# EAGLE design doodle with clock2 no fil (EAGLE 6.2)
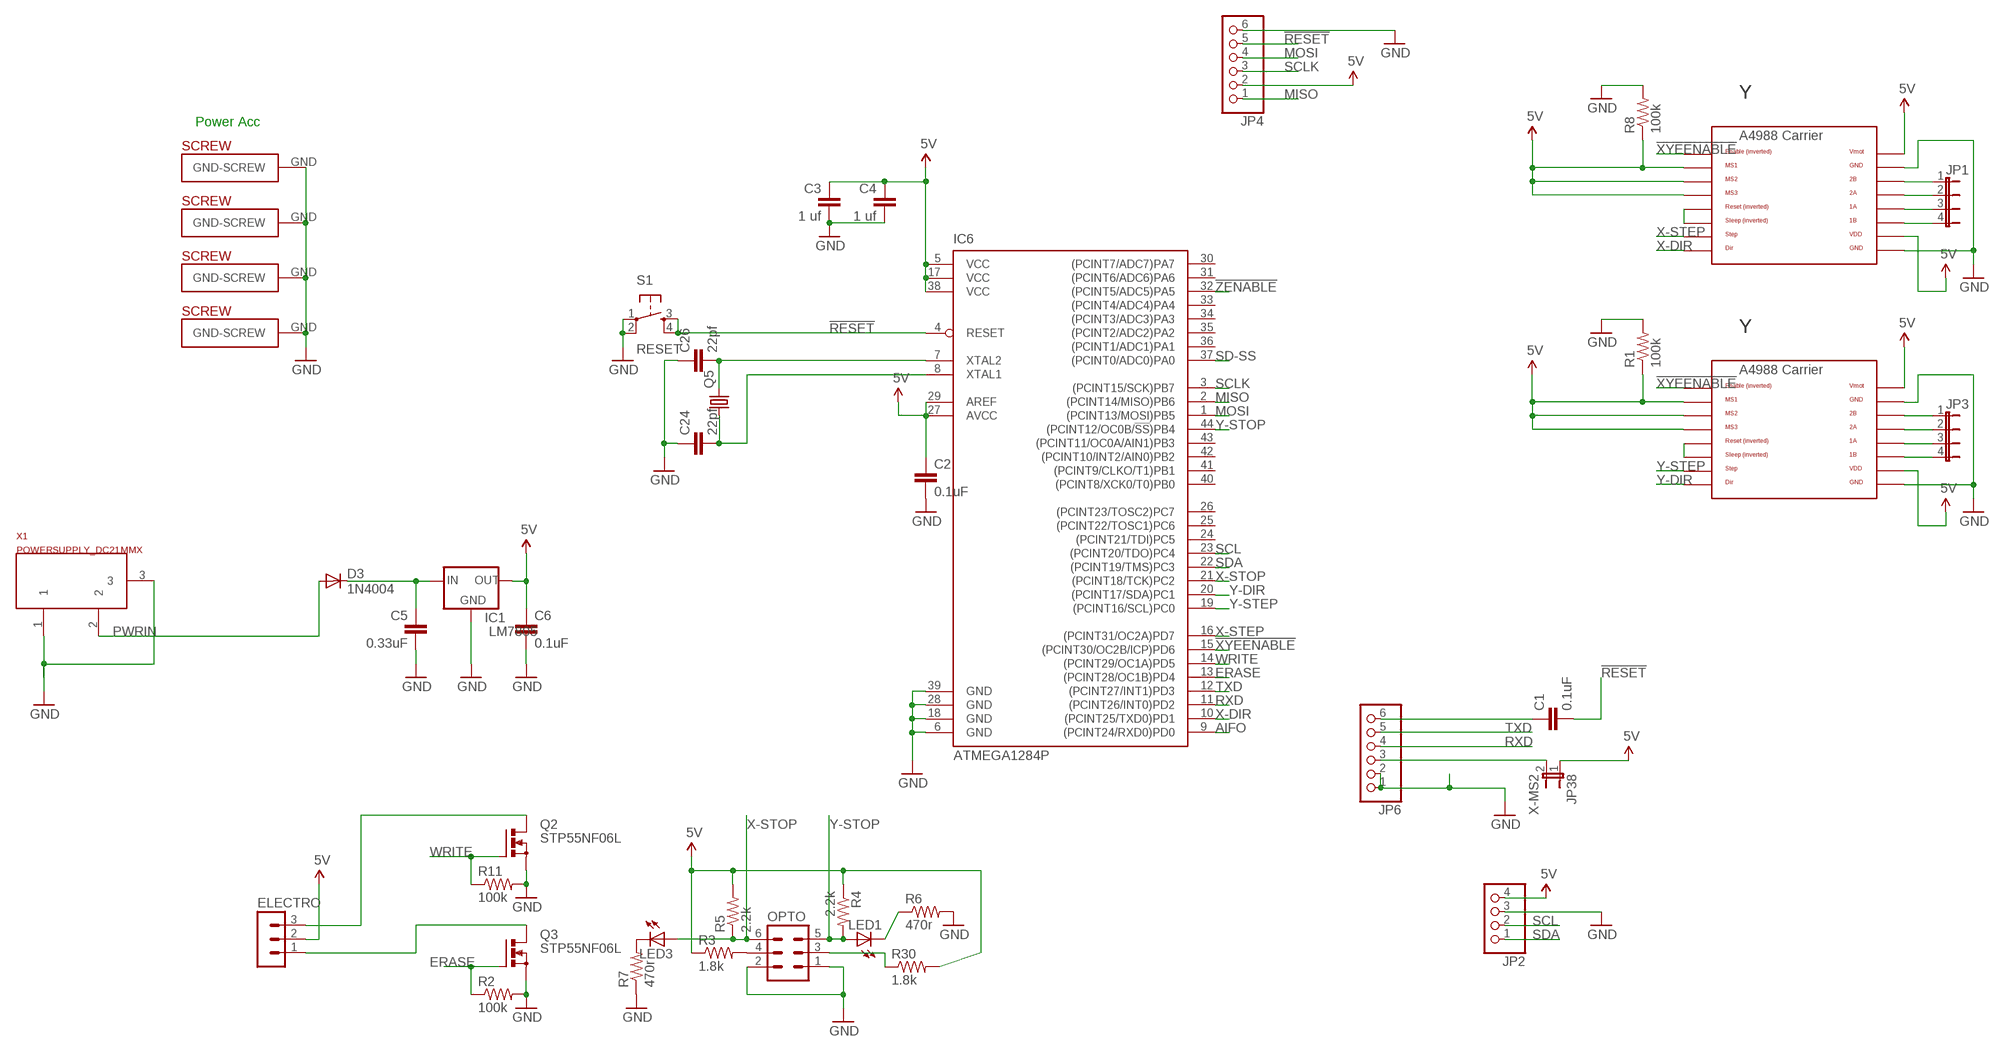
[diagram p0: schematic, sheet 1]

## Parts
C1  0.1uF  CAPPTH2  [CAP-PTH-SMALL2]
C2  0.1uF  CAPPTH2  [CAP-PTH-SMALL2]
C3  1 uf  CAPPTH2  [CAP-PTH-SMALL2]
C4  1 uf  CAPPTH2  [CAP-PTH-SMALL2]
C5  0.33uF  CAPPTH2  [CAP-PTH-SMALL2]
C6  0.1uF  CAPPTH2  [CAP-PTH-SMALL2]
C24  22pf  CAPPTH2  [CAP-PTH-SMALL2]
C26  22pf  CAPPTH2  [CAP-PTH-SMALL2]
D3  1N4004  [DO41-10]
ELECTRO  MA03-1  [MA03-1]
IC1  LM7805  V_REG_78XX  [78XXL-CUSTOM]
IC6  ATMEGA1284P  ATMEGA644A  [TQFP44]
JP1  JP4E  [JP4]
JP2  PINHD-1X4  [1X04]
JP3  JP4E  [JP4]
JP4  PINHD-1X6/90  [1X06/90]
JP6  PINHD-1X6  [1X06]
JP38  X-MS2  JUMPER-2PTH  [1X02]
LED1  LED3MM  [LED3MM]
LED3  LED3MM  [LED3MM]
OPTO  MA03-2  [MA03-2]
Q2  STP55NF06L  IRF512  [TO220BV]
Q3  STP55NF06L  IRF512  [TO220BV]
Q5  CRYSTALHC49S  [HC49/S]
R1  100k  R-US_0207/7  [0207/7]
R2  100k  R-US_0207/2V  [0207/2V]
R3  1.8k  R-US_0207/2V  [0207/2V]
R4  2.2k  R-US_0207/2V  [0207/2V]
R5  2.2k  R-US_0207/2V  [0207/2V]
R6  470r  R-US_0207/2V  [0207/2V]
R7  470r  R-US_0207/2V  [0207/2V]
R8  100k  R-US_0207/7  [0207/7]
R11  100k  R-US_0207/2V  [0207/2V]
R30  1.8k  R-US_0207/2V  [0207/2V]
S1  RESET  TAC_SWITCHPTH  [TACTILE-PTH]
U$1  A4988BREAKOUT  [A4988BREAKOUT]
U$7  A4988BREAKOUT  [A4988BREAKOUT]
U$14  PLATED-SCREW  [PLATEDSCREW]
U$17  PLATED-SCREW  [PLATEDSCREW]
U$18  PLATED-SCREW  [PLATEDSCREW]
U$38  PLATED-SCREW  [PLATEDSCREW]
X1  POWERSUPPLY_DC21MMX  [POWERSUPPLY_DC-21MM]

## Nets
5V: C2.1 C3.1 C4.1 C6.1 ELECTRO.2 IC1.OUT IC6.5(VCC) IC6.17(VCC) IC6.27(AVCC) IC6.29(AREF) IC6.38(VCC) JP2.4 JP4.2 JP38.1 R1.1 R3.1 R4.1 R5.2 R8.1 R30.2 U$1.MS1 U$1.MS2 U$1.MS3 U$1.VDD U$1.VMOT U$7.MS1 U$7.MS2 U$7.MS3 U$7.VDD U$7.VMOT
!RESET: C1.2 IC6.4(RESET) JP4.5 S1.3 S1.4
!XYEENABLE: IC6.15((PCINT30/OC2B/ICP)PD6) U$1.EN U$7.EN
!ZENABLE: IC6.32((PCINT5/ADC5)PA5)
AIFO: IC6.9((PCINT24/RXD0)PD0)
ERASE: IC6.13((PCINT28/OC1B)PD4) Q3.G R2.1
GND: C2.2 C3.2 C4.2 C5.2 C6.2 C24.1 C26.1 IC1.GND IC6.6(GND) IC6.18(GND) IC6.28(GND) IC6.39(GND) JP2.3 JP4.6 JP6.1 JP6.2 OPTO.1 OPTO.2 Q2.S Q3.S R1.2 R2.2 R6.2 R7.1 R8.2 R11.2 S1.1 S1.2 U$1.GND U$1.GND@0(GND) U$7.GND U$7.GND@0(GND) U$14.GND(GND-SCREW) U$17.GND(GND-SCREW) U$18.GND(GND-SCREW) U$38.GND(GND-SCREW) X1.1 X1.3
MISO: IC6.2((PCINT14/MISO)PB6) JP4.1
MOSI: IC6.1((PCINT13/MOSI)PB5) JP4.4
N$1: U$1.RST U$1.SLP(SLEEP)
N$2: JP3.1 U$1.2B
N$3: JP3.2 U$1.2A
N$4: JP3.3 U$1.1A
N$5: JP3.4 U$1.1B
N$8: ELECTRO.1 Q3.D
N$9: OPTO.4 R3.2
N$10: ELECTRO.3 Q2.D
N$11: LED1.K(C) R6.1
N$12: LED3.K(C) R7.2
N$13: OPTO.3 R30.1
N$14: JP1.1 U$7.2B
N$15: JP1.2 U$7.2A
N$16: JP1.3 U$7.1A
N$17: JP1.4 U$7.1B
N$23: U$7.RST U$7.SLP(SLEEP)
N$68: C5.1 D3.C IC1.IN
N$70: C1.1 JP6.6
N$71: JP6.3 JP38.2
N$80: C26.2 IC6.7(XTAL2) Q5.2
N$81: C24.2 IC6.8(XTAL1) Q5.1
PWRIN [Power]: D3.A X1.2
RXD: IC6.11((PCINT26/INT0)PD2) JP6.4
SCL: IC6.23((PCINT20/TDO)PC4) JP2.2
SCLK: IC6.3((PCINT15/SCK)PB7) JP4.3
SD-SS: IC6.37((PCINT0/ADC0)PA0)
SDA: IC6.22((PCINT19/TMS)PC3) JP2.1
TXD: IC6.12((PCINT27/INT1)PD3) JP6.5
WRITE: IC6.14((PCINT29/OC1A)PD5) Q2.G R11.1
X-DIR: IC6.10((PCINT25/TXD0)PD1) U$7.DIR
X-STEP: IC6.16((PCINT31/OC2A)PD7) U$7.STEP
X-STOP: IC6.21((PCINT18/TCK)PC2) LED3.A OPTO.6 R5.1
Y-DIR: IC6.20((PCINT17/SDA)PC1) U$1.DIR
Y-STEP: IC6.19((PCINT16/SCL)PC0) U$1.STEP
Y-STOP: IC6.44((PCINT12/OC0B/!SS!)PB4) LED1.A OPTO.5 R4.2
Unconnected: IC6.24((PCINT21/TDI)PC5) IC6.25((PCINT22/TOSC1)PC6) IC6.26((PCINT23/TOSC2)PC7) IC6.30((PCINT7/ADC7)PA7) IC6.31((PCINT6/ADC6)PA6) IC6.33((PCINT4/ADC4)PA4) IC6.34((PCINT3/ADC3)PA3) IC6.35((PCINT2/ADC2)PA2) IC6.36((PCINT1/ADC1)PA1) IC6.40((PCINT8/XCK0/T0)PB0) IC6.41((PCINT9/CLKO/T1)PB1) IC6.42((PCINT10/INT2/AIN0)PB2) IC6.43((PCINT11/OC0A/AIN1)PB3)

## Notes on the sheet
- Y
- Power Acc
- Y

## Library data of the parts
C1-C6 C24 C26 = SparkFun:CAP: Capacitor Standard 0603 ceramic capacitor, and 0.1" leaded capacitor.
D3 = diode:1N4004: DIODE general purpose rectifier, 1 A
ELECTRO = con-lstb:MA03-1: PIN HEADER; OC_FARNELL: unknown; OC_NEWARK: unknown
IC1 = SparkFun:V_REG_78XX: Voltage Regulator Standard 7805 5V regulator. IGO (Input Ground Output). Spark Fun Electronics SKU : COM-00107
IC6 = atmel:ATMEGA644: 8-bit Microcontroller with 64K Bytes In-System Programmable Flash Source: http://www.atmel.com/dyn/resources/prod_documents/doc2593.pdf; MPN: ATMEGA644PV-10AU; OC_FARNELL: 1455123; OC_NEWARK: 58M3748
JP1 JP3 = jumper:JP4E: JUMPER
JP2 = pinhead:PINHD-1X4: PIN HEADER
JP4 JP6 = pinhead:PINHD-1X6: PIN HEADER
JP38 = SparkFun:JUMPER-2: Jumper Basic 0.1" spaced jumper. Use with breakaway headers.
LED1 LED3 = led:LED: LED OSRAM: - CHIPLED LG R971, LG N971, LY N971, LG Q971, LY Q971, LO R971, LY R971 LH N974, LH R974 LS Q976, LO Q976, LY Q976 LO Q996 - Hyper CHIPLED LW Q18S LB Q993, LB Q99A, LB R99A - SideLED LS A670, LO A670, LY A670, LG A670, LP A670 LB A673, LV A673, LT A673, LW A673 LH A674 LY A675 LS A676, LA A676, LO A676, LY A676, LW A676 LS A679, LY A679, LG A679 - Hyper Micro SIDELED® LS Y876, LA Y876, LO Y876, LY Y876 LT Y87S - SmartLED LW L88C, LW L88S LB L89C, LB L89S, LG L890 LS L89K, LO L89K, LY L89K LS L896, LA L896, LO L896, LY L896 - TOPLED LS T670, LO T670, LY T670, LG T670, LP T670 LSG T670, LSP T670, LSY T670, LOP T670, LYG T670 LG T671, LOG T671, LSG T671 LB T673, LV T673, LT T673, LW T673 LH T674 LS T676, LA T676, LO T676, LY T676, LB T676, LH T676, LSB T676, LW T676 LB T67C, LV T67C, LT T67C, LS T67K, LO T67K, LY T67K, LW E67C LS E67B, LA E67B, LO E67B, LY E67B, LB E67C, LV E67C, LT E67C LW T67C LS T679, LY T679, LG T679 LS T770, LO T770, LY T770, LG T770, LP T770 LB T773, LV T773, LT T773, LW T773 LH T774 LS E675, LA E675, LY E675, LS T675 LS T776, LA T776, LO T776, LY T776, LB T776 LHGB T686 LT T68C, LB T68C - Hyper Mini TOPLED® LB M676 - Mini TOPLED Santana® LG M470 LS M47K, LO M47K, LY M47K Source: http://www.osram.convergy.de LUXEON: - LUMILED® LXK2-PW12-R00, LXK2-PW12-S00, LXK2-PW14-U00, LXK2-PW14-V00 LXK2-PM12-R00, LXK2-PM12-S00, LXK2-PM14-U00 LXK2-PE12-Q00, LXK2-PE12-R00, LXK2-PE12-S00, LXK2-PE14-T00, LXK2-PE14-U00 LXK2-PB12-K00, LXK2-PB12-L00, LXK2-PB12-M00, LXK2-PB14-N00, LXK2-PB14-P00, LXK2-PB14-Q00 LXK2-PR12-L00, LXK2-PR12-M00, LXK2-PR14-Q00, LXK2-PR14-R00 LXK2-PD12-Q00, LXK2-PD12-R00, LXK2-PD12-S00 LXK2-PH12-R00, LXK2-PH12-S00 LXK2-PL12-P00, LXK2-PL12-Q00, LXK2-PL12-R00 Source: www.luxeon.com KINGBRIGHT: KA-3528ASYC Source: www.kingbright.com
OPTO = con-lstb:MA03-2: PIN HEADER; OC_FARNELL: unknown; OC_NEWARK: unknown
Q2 Q3 = transistor-power:IRF512: N-CHANNEL MOS FET
Q5 = crystal:CRYSTAL: CRYSTAL; OC_FARNELL: 1667008; OC_NEWARK: unknown
R1 R8 = adafruit:R-US_: RESISTOR, American symbol
R2-R7 R11 R30 = resistor:R-US_: RESISTOR, American symbol
S1 = SparkFun:TAC_SWITCH: Momentary Switch Button commonly used for reset or general input. Spark Fun Electronics SKU : COM-00097
U$1 U$7 = RepRapjr:A4988BREAKOUT
U$14 U$17 U$18 U$38 = Sanguinololu:PLATED-SCREW
X1 = SmartPrj:POWERSUPPLY_DC21MM

## Net classes
1 Power: width 0.3 mm, drill 0.406 mm, clearance 0.178 mm
2 gnd: width 0.305 mm, drill 0.559 mm, clearance 0.254 mm

## Board
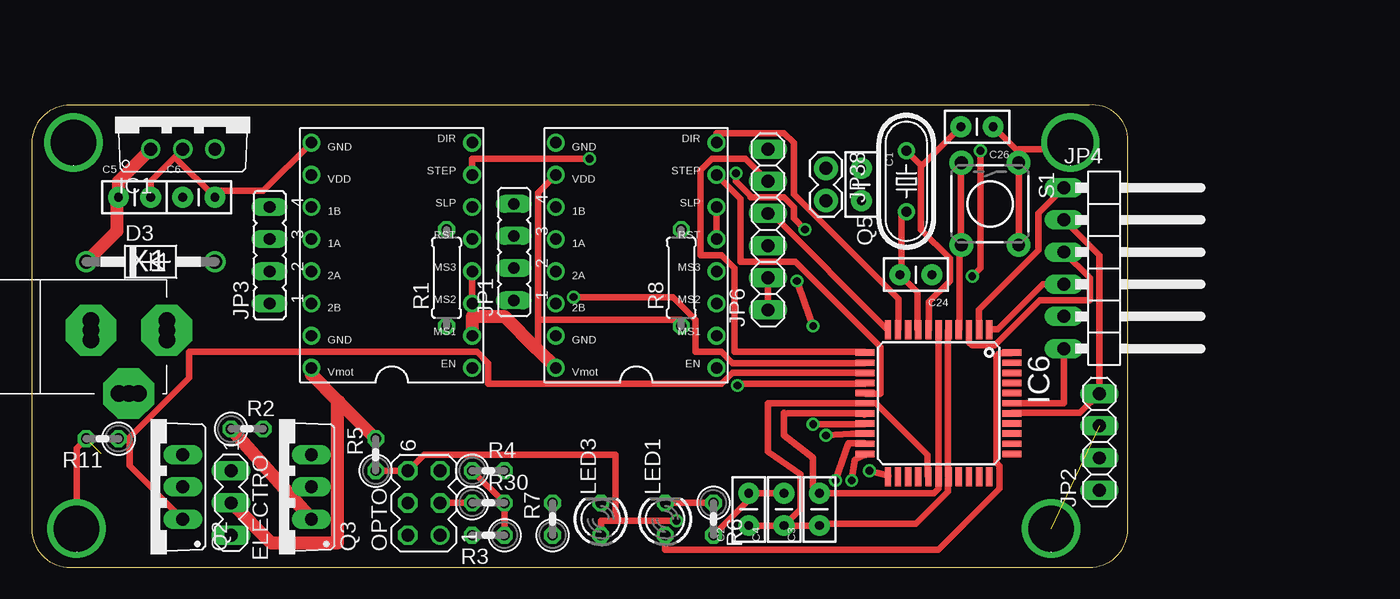
[diagram p1: board, top side]
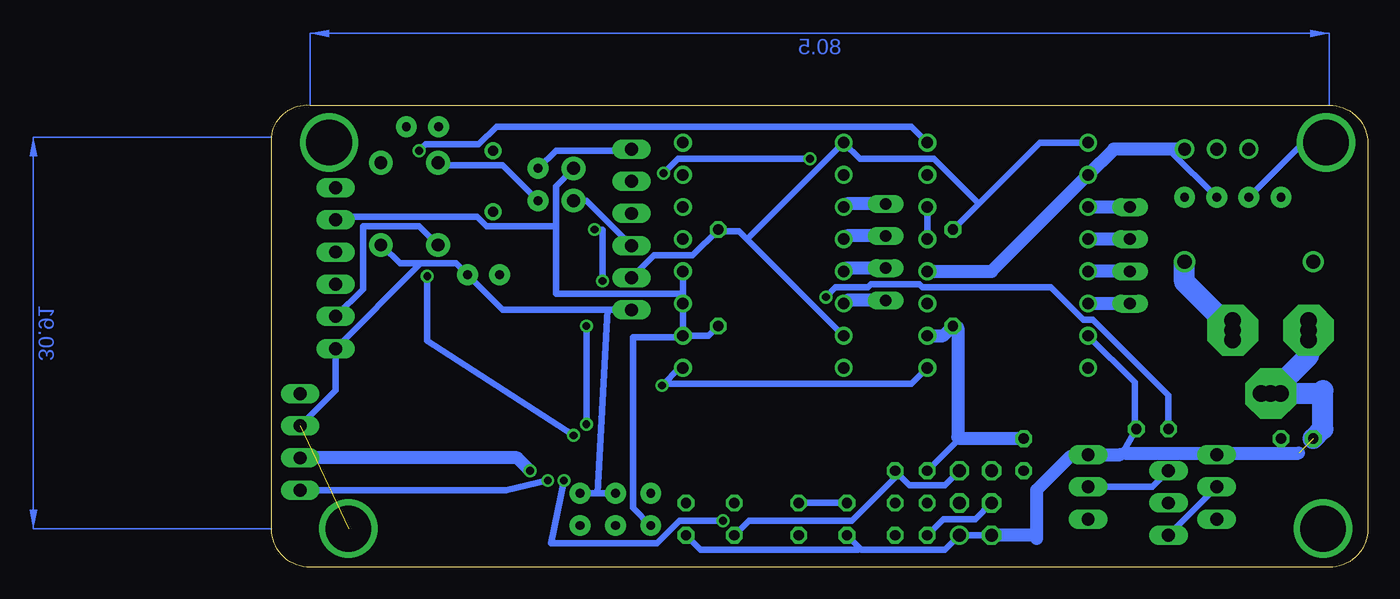
[diagram p2: board, bottom side, seen from below]

Size 86.59 x 36.51 mm. Coordinates in mm from the lower left corner, seen from the top.
Outline: 0,33.45 0,3.05 arc90 3.05,0 83.55,0 arc90 86.59,3.05 86.59,33.96 arc90 83.55,36.5 3.05,36.5 arc90 0,33.45
Copper layers (1*16): Top 0.035mm / dielectric 1.5mm / Bottom 0.035mm
Design rules: minimum track width 20mil, minimum drill 24mil, track to track 8mil, track to pad 8mil, pad to pad 8mil, via to via 8mil, smd to smd 8mil, copper to edge 40mil, drill to drill 8mil, minimum pad ring 10mil, minimum via ring 8mil, stop-mask expansion 4mil, vias tented up to drill 0mil, thermal gap 10mil

### Footprints (pad centres in the part's own frame; a part is rotated, then mirrored left to right if it is on the bottom)
CAP-PTH-SMALL2 = drill 0.7 pad 1.651: 1 0,0; 2 2.54,0
DO41-10 = drill 1.118: A 5.08,0; C -5.08,0
MA03-1 = drill 1.016 long: 1 -2.54,0; 2 0,0; 3 2.54,0
78XXL-CUSTOM = drill 1.016: GND 0,0; IN -2.54,0; OUT 2.54,0
TQFP44 = smd 1.5 x 0.5: 1 -5.8,4; 2 -5.8,3.2; 3 -5.8,2.4; 4 -5.8,1.6; 5 -5.8,0.8; 6 -5.8,0; 7 -5.8,-0.8; 8 -5.8,-1.6; 9 -5.8,-2.4; 10 -5.8,-3.2; 11 -5.8,-4; 23 5.8,-4; 24 5.8,-3.2; 25 5.8,-2.4; 26 5.8,-1.6; 27 5.8,-0.8; 28 5.8,0; 29 5.8,0.8; 30 5.8,1.6; 31 5.8,2.4; 32 5.8,3.2; 33 5.8,4 | smd 0.5 x 1.5: 12 -4,-5.8; 13 -3.2,-5.8; 14 -2.4,-5.8; 15 -1.6,-5.8; 16 -0.8,-5.8; 17 0,-5.8; 18 0.8,-5.8; 19 1.6,-5.8; 20 2.4,-5.8; 21 3.2,-5.8; 22 4,-5.8; 34 4,5.8; 35 3.2,5.8; 36 2.4,5.8; 37 1.6,5.8; 38 0.8,5.8; 39 0,5.8; 40 -0.8,5.8; 41 -1.6,5.8; 42 -2.4,5.8; 43 -3.2,5.8; 44 -4,5.8
JP4 = drill 0.914 long: 1 -3.81,0; 2 -1.27,0; 3 1.27,0; 4 3.81,0
1X04 = drill 1.016 long: 1 -3.81,0; 2 -1.27,0; 3 1.27,0; 4 3.81,0
1X06/90 = drill 1.016 long: 1 -6.35,-3.81; 2 -3.81,-3.81; 3 -1.27,-3.81; 4 1.27,-3.81; 5 3.81,-3.81; 6 6.35,-3.81
1X06 = drill 1.016 long: 1 -6.35,0; 2 -3.81,0; 3 -1.27,0; 4 1.27,0; 5 3.81,0; 6 6.35,0
1X02 = drill 1.016 pad 1.88: 1 0,0; 2 2.54,0
LED3MM = drill 0.813 octagon: A -1.27,0; K 1.27,0
MA03-2 = drill 1.016: 1 -2.54,-1.27 | drill 1.016 octagon: 2 -2.54,1.27; 3 0,-1.27; 4 0,1.27; 5 2.54,-1.27; 6 2.54,1.27
TO220BV = drill 1.016 long: D 0,-2.54; G -2.54,-2.54; S 2.54,-2.54
HC49/S = drill 0.813: 1 -2.413,0; 2 2.413,0
0207/7 = drill 0.813 octagon: 1 -3.81,0; 2 3.81,0
0207/2V = drill 0.813 octagon: 1 -1.27,0; 2 1.27,0
TACTILE-PTH = drill 1.016 pad 1.88: 1 -3.251,2.261; 2 3.251,2.261; 3 -3.251,-2.261; 4 3.251,-2.261
A4988BREAKOUT = drill 0.9: 1A 8.89,1.27; 1B 11.43,1.27; 2A 6.35,1.27; 2B 3.81,1.27; DIR 16.51,-11.43; EN -1.27,-11.43; GND 16.51,1.27; GND@0 1.27,1.27; MS1 1.27,-11.43; MS2 3.81,-11.43; MS3 6.35,-11.43; RST 8.89,-11.43; SLP 11.43,-11.43; STEP 13.97,-11.43; VDD 13.97,1.27; VMOT -1.27,1.27
PLATEDSCREW = drill 3.6: GND 0,0
POWERSUPPLY_DC-21MM = drill 1.3 pad 4 octagon: 1 -5.08,-3.353; 2 -0.076,-6.35; 3 -0.076,-0.356 | drill 1.3: 4 -5.08,-4.115; 5 -5.08,-2.591; 6 -0.838,-0.356; 7 0.686,-0.356; 8 -0.838,-6.35; 9 0.686,-6.35

### Placement (x,y rotation side)
C1  65.53,31.5 270 top
C2  56.64,3.3 90 top
C3  62.23,3.3 90 top
C4  59.44,3.3 90 top
C5  6.86,29.21 0 top
C6  11.94,29.21 0 top
C24  71.12,23.11 180 top
C26  75.95,34.8 180 top
D3  9.4,24.13 0 top
ELECTRO  15.75,5.08 270 top
IC1  11.94,33.02 0 top
IC6  71.63,12.95 270 top
JP1  38.1,24.89 90 top
JP2  84.33,9.91 90 top
JP3  18.8,24.64 90 top
JP4  85.34,23.62 270 top
JP6  58.17,26.67 90 top
JP38  62.74,31.5 270 top
LED1  50.04,3.81 90 top
LED3  44.96,3.81 90 top
OPTO  30.99,5.08 90 top
Q2  9.4,6.35 90 top
Q3  19.56,6.35 90 top
Q5  69.09,30.48 90 top
R1  32.77,22.86 90 top
R2  17.02,10.92 0 top
R3  36.07,2.54 180 top
R4  36.07,7.62 0 top
R5  27.18,8.89 90 top
R6  53.85,3.81 270 top
R7  41.15,3.81 90 top
R8  51.31,22.86 90 top
R11  5.59,10.16 180 top
R30  36.07,5.08 0 top
S1  75.69,28.7 270 top
U$1  23.37,17.02 90 top
U$7  42.67,17.02 90 top
U$14  3.3,33.53 0 top
U$17  3.56,3.05 0 top
U$18  80.52,3.05 0 top
U$38  82.04,33.53 0 top
X1  4.32,18.8 90 top

### Tracks (layer width: path | path; a pad name or v marks a point on that pad's centre or on a via)
5V
  Top 0.508: R3.1 R30.2 R4.1 | U$1.VMOT 22.1,15.24 | 24.13,12.95 24.26,13.08 | 34.8,19.81 U$1.MS2 U$1.MS3 | U$7.VDD 40.01,29.59 40.01,19.56 | 40.01,19.56 40.01,17.4 39.88,17.27 | IC6.5 72.39,18.67 72.39,7.24 IC6.29 72.39,6.99 72.39,5.97 69.85,3.43 62.36,3.43 C3.1 C4.1 | IC6.27 70.74,7.24 70.74,8.89 66.67,12.95 IC6.17 58.17,12.95 58.17,9.14 60.71,7.37 60.71,4.57 C4.1 | C4.1 C2.1 | IC6.38 77.47,12.19 82.8,12.19 JP2.4 84.33,24.64 JP4.2 | 40.01,19.56 51.31,19.56 R8.1
  Top 1.016: 22.1,15.24 24.26,13.08 R5.2 | ELECTRO.2 18.92,1.91 24.13,1.91 24.13,12.95 | U$7.VMOT 39.88,17.27 37.34,19.81 34.8,19.81 U$1.MS1
  Bottom 0.508: R4.1 32.26,10.16 32.38,10.29 | C6.1 15.62,32.89 15.62,33.02 | 32.64,18.92 R1.1 | R8.1 52.07,18.29 U$7.MS1 | U$7.MS1 U$7.MS2 54.1,21.59 | 54.1,21.59 U$7.MS3 | JP38.1 64.14,30.1 64.14,26.92 | 64.14,26.92 64.14,21.59 54.1,21.59 | JP4.2 81.28,27.69 70.36,27.69 69.6,26.92 64.14,26.92 | C2.1 58.04,4.7 58.04,18.16 54.23,18.16 U$7.MS1
  Bottom 1.016: R5.2 32.26,10.16 | IC1.OUT 15.62,33.02 20.07,33.02 U$1.VDD 29.72,23.37 U$1.MS3 | R1.1 33.53,18.29 U$1.MS1 | 32.38,10.29 32.38,18.92 32.64,18.92
!RESET
  Top 0.508: IC6.4 73.28,18.8 73.28,25.27 73.41,25.4 S1.4 73.41,25.65 73.41,31.88 S1.3
  Bottom 0.508: C1.2 68.33,31.75 73.28,31.75 73.41,31.88 S1.3 | JP4.5 79.38,21.97 79.38,26.92 74.93,26.92 73.53,25.53 S1.4
!XYEENABLE  (via drill 0.61)
  Top 0.508: v55.75,14.35 55.75,14.48 65.79,14.48 IC6.15
  Bottom 0.508: U$7.EN 54.36,15.75 v55.75,14.35 55.37,14.48 36.07,14.48 U$1.EN
ERASE  (via drill 0.61)
  Top 0.508: v42.8,21.34 50.67,21.34 52.45,19.56 52.45,17.02 54.48,17.02 55.37,16.13 65.79,16.13 IC6.13
  Top 1.016: R2.1 Q3.G
  Bottom 0.508: v42.8,21.34 42.04,22.1 39.5,22.1 39.24,22.35 35.43,22.35 35.18,22.1 25.02,22.1 22.48,19.56 21.72,19.56 15.75,13.59 R2.1
GND  (2 unrouted)
  Top 0.406: C3.2 61.72,6.35 | 59.44,12.19 59.73,12.15
  Top 0.508: R6.2 56.64,5.33 C2.2 C4.2 | IC6.6 IC6.28 71.63,6.22 71.25,5.84 C3.2 | 65.79,12.06 IC6.18 59.73,12.15 | R11.2 3.56,9.4 U$17.GND | IC6.39 81.53,12.95 JP4.6 | 77.85,32.89 C26.1 | 77.85,32.89 77.85,32 S1.1 77.98,31.75 77.98,25.53 S1.2 | U$38.GND 83.31,33.02 77.98,33.02 77.85,32.89 | JP6.2 JP6.1 | 11.3,32.38 9.4,30.48 C5.2 | 11.3,32.38 IC1.GND | 11.3,32.38 C6.2 14.22,29.72 18.29,29.72 U$1.GND | 61.72,6.35 61.72,8.64 59.44,10.41 59.44,12.19
  Bottom 0.508: C3.2 60.83,5.84 | 60.83,5.84 C4.2 | 40.13,1.52 40.01,1.4 33.4,1.4 OPTO.1 OPTO.2 | 40.13,1.52 R7.1 | 19.56,8.89 19.3,9.14 | 19.3,9.14 R2.2 18.41,11.05 18.41,14.61 U$1.GND@0 | 12.07,9.02 Q2.S 11.81,9.02 | 19.18,9.02 19.3,9.14 | 23.49,8.76 22.22,8.76 Q3.S | R6.2 52.71,1.4 40.26,1.4 40.13,1.52 | JP2.3 81.53,13.97 JP4.6 74.93,23.88 74.93,24 | 74.93,24 76.45,24 77.85,25.4 S1.2 | 74.93,24 72.01,24 C24.1 68.33,20.32 60.07,20.32 | JP6.2 56.39,24.64 53.34,24.64 R8.2 51.18,26.54 49.66,26.54 49.02,25.91 | 49.02,25.91 U$7.GND@0 | 49.02,25.91 U$7.GND 40.13,32.26 34.29,32.26 30.73,28.7 | 30.73,28.7 25.91,33.53 U$1.GND | 30.73,28.7 R1.2 | C5.2 5.08,33.53 U$14.GND | JP6.1 60.07,20.32 | 60.07,20.32 60.83,5.84
  Bottom 1.016: Q3.S 19.56,8.89 | 19.18,9.02 12.07,9.02 | 11.81,9.02 5.46,9.02 | 23.49,8.76 26.16,6.1 26.16,2.29 26.42,2.54 OPTO.2
  Bottom 1.676: R11.2 3.56,10.92 3.56,13.97 3.81,13.72 X1.1 4.67,16.71 X1.3
MISO
  Top 0.508: JP4.1 79.5,27.94 79.5,25.02 74.8,20.32 74.8,18.8 IC6.2
MOSI
  Top 0.508: JP4.4 79.88,22.35 76.33,18.8 75.69,18.8 IC6.1
N$1
  Bottom 0.508: U$1.SLP U$1.RST
N$2
  Bottom 1.016: JP3.1 U$1.2B
N$3
  Bottom 1.016: JP3.2 U$1.2A
N$4
  Bottom 1.016: JP3.3 U$1.1A
N$5
  Bottom 1.016: JP3.4 U$1.1B
N$8
  Bottom 0.508: ELECTRO.1 17.02,6.35 Q3.D
N$9
  Bottom 0.508: R3.2 33.53,3.81 30.99,3.81 OPTO.4
N$10
  Bottom 0.508: ELECTRO.3 Q2.D
N$11
  Top 0.508: R6.1 LED1.K
N$12
  Bottom 0.508: LED3.K R7.2
N$13
  Top 0.508: OPTO.3 R30.1
N$14
  Bottom 1.016: U$7.2B 41.15,21.08 JP1.1
N$15
  Bottom 1.016: U$7.2A 41.15,23.62 JP1.2
N$16
  Bottom 1.016: U$7.1A 41.15,26.16 JP1.3
N$17
  Bottom 1.016: U$7.1B 41.15,28.7 JP1.4
N$23
  Top 0.508: U$7.SLP U$7.RST
N$68
  Top 0.508: 6.73,29.08 C5.1
  Top 1.016: IC1.IN 6.86,30.48 C5.1 | D3.C 6.73,26.54 6.73,29.08
N$70
  Bottom 0.508: JP6.6 58.29,32.89 64.14,32.89 C1.1
N$71
  Bottom 0.508: JP6.3 61.72,28.96 JP38.2
N$80
  Top 0.508: 70.23,31.75 70.23,26.67 72.52,24.38 72.52,22.61 70.87,20.95 70.87,18.8 IC6.7 | Q5.2 70.23,31.75 | C26.2 70.36,31.75 70.23,31.75
N$81
  Top 0.508: IC6.8 69.98,18.8 69.98,21.72 C24.2 68.71,23.24 68.71,27.69 Q5.1
PWRIN
  Bottom 1.676: X1.2 14.48,22.53 D3.A
RXD
  Top 0.508: JP6.4 58.42,27.94 67.56,18.8 IC6.11
SCL  (via drill 0.61)
  Top 0.508: v66.17,7.62 67.69,7.24 IC6.23
  Bottom 1.016: v66.17,7.62 67.18,8.64 JP2.2
SCLK
  Top 0.508: JP4.3 83.57,22.86 83.57,21.08 79.63,21.08 76.07,17.53 74.3,17.53 74.04,17.78 74.04,18.67 IC6.3
SDA  (via drill 0.61)
  Top 0.508: v64.77,6.86 65.02,8.51 65.91,8.89 IC6.22
  Bottom 0.508: v64.77,6.86 68.07,6.1 JP2.1
TXD
  Top 0.508: JP6.5 56.39,32.26 53.72,32.26 52.83,31.37 52.83,24.64 54.48,24.64 55.5,23.62 55.5,17.02 65.79,17.02 IC6.12
WRITE
  Top 0.508: 7.62,10.16 12.45,14.99 12.45,17.02 35.18,17.02 36.07,16.13 36.07,14.48 54.48,14.48 55.37,15.37 65.79,15.37 IC6.14 | R11.1 7.62,10.16 | Q2.G 7.75,8 7.75,10.03 7.62,10.16
X-DIR
  Top 0.508: U$7.DIR 54.1,34.29 59.44,34.29 60.2,33.53 60.2,29.46 68.45,21.21 68.45,18.8 IC6.10
X-STEP
  Top 0.508: U$7.STEP 56.01,29.08 56.01,24.13 60.33,24.13 67.06,17.4 67.06,13.72 65.91,13.72 IC6.16
X-STOP  (via drill 0.61)
  Top 0.508: R5.1 OPTO.6 30.99,8.89 46.1,8.89 46.1,3.68 | v63.5,6.86 64.52,9.78 65.79,9.78 IC6.21 | 46.1,3.68 44.96,3.68 LED3.A | 46.1,3.68 v50.93,3.68
  Bottom 0.508: v63.5,6.86 64.52,1.91 56.13,1.91 54.36,3.68 v50.93,3.68
Y-DIR  (via drill 0.61)
  Top 0.508: v62.74,10.41 64.77,10.54 65.91,10.54 IC6.20 | v74.3,22.99 74.93,23.62 v74.93,32.89
  Bottom 0.508: v62.74,10.41 74.3,17.91 v74.3,22.99 | v74.93,32.89 74.42,33.4 70.23,33.4 68.83,34.8 36.07,34.8 U$1.DIR
Y-STEP  (via drill 0.61)
  Top 0.508: v61.72,11.3 65.79,11.3 IC6.19 | v60.45,22.61 v61.72,19.05 | v61.09,26.67 60.2,27.56 60.2,28.45 59.44,29.21 56.77,29.21 56.77,29.34 55.63,30.48 v55.63,31.11 | v44.07,32.26 34.8,32.26 U$1.STEP
  Bottom 0.508: v61.72,19.05 v61.72,11.3 | v60.45,22.61 60.45,26.67 v61.09,26.67 | v55.63,31.11 54.48,32.26 v44.07,32.26
Y-STOP
  Top 0.508: LED1.A 50.04,1.4 71.63,1.4 76.45,6.22 76.45,8 76.2,8.26 76.2,16.64 76.45,16.89 77.34,16.89 IC6.44
  Bottom 0.508: OPTO.5 33.4,6.48 36.2,6.48 R4.2 37.21,7.24 40.77,3.68 48.9,3.68 LED1.A
(copper drawn outside any net)
  shapes: Bottom area x2